# Altium schematic sheet LTC3119 Buck Boost Converter.SchDoc
size Letter; Organization: Altium Limited; Address1: L3, 12a Rodborough Rd; Address2: Frenchs Forest; Address3: NSW; Address4: Australia 2086; CopyrightYear: 2019
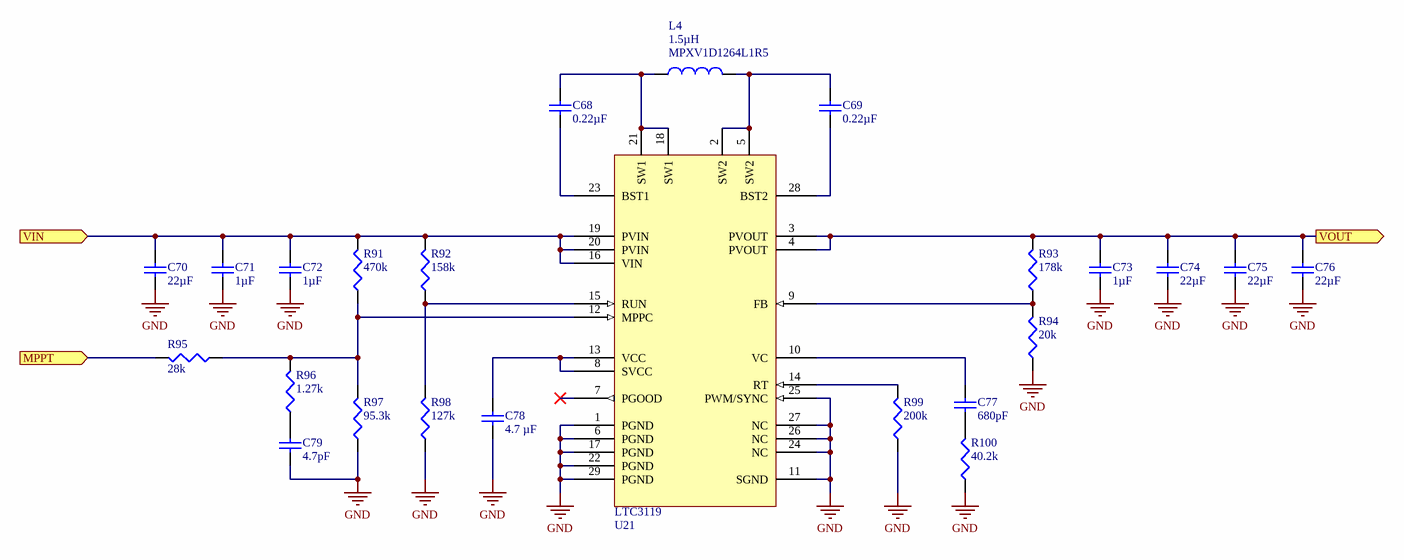
[diagram p0: LTC3119 Buck Boost Converter.SchDoc]

## Parts
C68  value 0.22µF  [TDK-CGA3E]  (hidden comment: Cap)
C69  value 0.22µF  [TDK-CGA3E]  (hidden comment: Cap)
C70  value 22µF  [TDK-C3225]  (hidden comment: Cap)
C71  value 1µF  [TY-0603A]  (hidden comment: Cap)
C72  value 1µF  [TY-0603A]  (hidden comment: Cap)
C73  value 1µF  [TY-0603A]  (hidden comment: Cap)
C74  value 22µF  [TDK-C3225]  (hidden comment: Cap)
C75  value 22µF  [TDK-C3225]  (hidden comment: Cap)
C76  value 22µF  [TDK-C3225]  (hidden comment: Cap)
C77  value 680pF  [TDK-CGA2B]  (hidden comment: Cap)
C78  value 4.7 µF  [MUR-GRM188]  (hidden comment: Cap)
C79  value 4.7pF  [TDK-CGA2B]  (hidden comment: Cap)
L4  value 1.5µH  Manufacturer Part Number: MPXV1D1264L1R5  [KEM-MPXV1D1264L100]  (hidden comment: Inductor)
R91  value 470k  [VSH-0402MCS]  (hidden comment: Res3)
R92  value 158k  [TEC-RP731E]  (hidden comment: Res3)
R93  value 178k  [TEC-RP731E]  (hidden comment: Res3)
R94  value 20k  [TEC-RP731E]  (hidden comment: Res3)
R95  value 28k  [TEC-RP731E]  (hidden comment: Res3)
R96  value 1.27k  [TEC-RP731E]  (hidden comment: Res3)
R97  value 95.3k  [TEC-RP731E]  (hidden comment: Res3)
R98  value 127k  [TEC-RP731E]  (hidden comment: Res3)
R99  value 200k  [TEC-RP731E]  (hidden comment: Res3)
R100  value 40.2k  [TEC-RP731E]  (hidden comment: Res3)
U21  LTC3119  [LT-05-08-1712C]

## Ports
MPPT (in), VIN (in), VOUT (out)

## Nets
GND: C70.1 C71.1 C72.1 C73.1 C74.1 C75.1 C76.1 C78.1 C79.1 R94.1 R97.1 R98.1 R99.1 R100.1 U21.1(PGND) U21.6(PGND) U21.11(SGND) U21.17(PGND) U21.22(PGND) U21.24(NC) U21.25(PWM/SYNC) U21.26(NC) U21.27(NC) U21.29(PGND)
MPPT: R95.2 ; port MPPT
VIN: C70.2 C71.2 C72.2 R91.2 R92.2 U21.16(VIN) U21.19(PVIN) U21.20(PVIN) ; port VIN
VOUT: C73.2 C74.2 C75.2 C76.2 R93.2 U21.3(PVOUT) U21.4(PVOUT) ; port VOUT
NetC68_1: C68.1 U21.23(BST1)
NetC68_2: C68.2 L4.1 U21.18(SW1) U21.21(SW1)
NetC69_1: C69.1 U21.28(BST2)
NetC69_2: C69.2 L4.2 U21.2(SW2) U21.5(SW2)
NetC77_1: C77.1 R100.2
NetC77_2: C77.2 U21.10(VC)
NetC78_2: C78.2 U21.8(SVCC) U21.13(VCC)
NetC79_2: C79.2 R96.1
NetR91_1: R91.1 R95.1 R96.2 R97.2 U21.12(MPPC)
NetR92_1: R92.1 R98.2 U21.15(RUN)
NetR93_1: R93.1 R94.2 U21.9(FB)
NetR99_2: R99.2 U21.14(RT)

Not connected (* = marked no-connect by the designer): U21 7(PGOOD)*

## Notes on the sheet
- (the "License"); you may not use or redistribute this file except in compliance with the License. You
- This file and the information within it are licensed under the terms of the Apache License, Version 2.0
- Copyright
- Unless required by applicable law or agreed to in writing, content distributed under the License is
- distributed on an "AS IS" BASIS, WITHOUT WARRANTIES OR CONDITIONS OF ANY KIND,
- either express or implied. See the License for the specific language governing permissions and
- limitations under the License.
- may obtain a copy of the License at:
- http://www.apache.org/licenses/LICENSE-2.0
- Title
- Size:
- Date:
- Letter
- Number:
- Time:
- Revision:
- Sheet
- of
- University of Alberta
- Deptartment of Electrical
- and Computer Engineering
- Edmonton AB, Canada
- T6G 1H9
- File:

## Library data of the parts
C68 C69 = PC-TDK-02393: CAP CER 0.22UF 50V X7R 0603; Manufacturer Part Number: CGA3E3X7R1H224K080AB; Index: 2393; Designator: C?; Tolerance: ±10%; Published: 2016-03-16; LatestRevisionDate: 2016-03-16; LatestRevisionNote: ...; PackageReference: 0603 (1608 Metric); Publisher: AlbertaSat; PackageDescription: Radial Cap, Thru-Hole; 2 Leads; 0.3 in Pin Spacing; Part Number: PC-TDK-02393; Supplier Part Number 1: 445-6926-1-ND; Supplier 1: Digi-key; Supplier Link: http://www.digikey.ca/product-search/en?keywords=445-6926-1-ND; Voltage - Rated: 50V; Temperature Coefficient: X7R; Applications: Automotive; Operating Temperature: -55°C ~ 125°C
C70 C74-C76 = PC-TDK-02965: CAP CER 22UF 25V X7R 1210; Manufacturer Part Number: C3225X7R1E226M250AB; Index: 2965; Designator: C?; Tolerance: ±20%; Code_IEC: 3225; Published: 2022-10-26; LatestRevisionDate: 2022-10-26; LatestRevisionNote: ...; PackageReference: 1210 (3225 Metric); Publisher: AlbertaSat; PackageDescription: Chip Capacitor, 2-Leads, Body 3.20x2.50mm, IPC Low Density; Part Number: PC-TDK-02965; Supplier Part Number 1: 445-181602-1-ND; Supplier 1: Digi-key; Supplier Part Number 2: 810-C3225X7R1EM250AB; Supplier 2: Mouser; Supplier Link: #https://www.digikey.ca/en/products/detail/tdk-corporation/C3225X7R1E226M250AB/9991387#; Voltage - Rated: 25V; Temperature Coefficient: X7R; Applications: General Purpose; Code_JEITA: 1210; Operating Temperature: -55°C ~ 125°C
C71-C73 = PC-TY-00404: CAP CER 1UF 50V X7R 0603; Manufacturer Part Number: UMK107AB7105KA-T; Index: 404; Designator: C?; Tolerance: ±10%; Published: 2016-03-13; LatestRevisionDate: 2016-03-13; LatestRevisionNote: ...; PackageReference: 0603 (1608 Metric); Publisher: AlbertaSat; PackageDescription: Chip Capacitor, 2-Leads, Body 1.60x0.80mm, IPC Low Density; Part Number: PC-TY-00404; Supplier Part Number 1: 587-3247-1-ND; Supplier 1: Digi-key; Supplier Link: http://www.digikey.ca/product-search/en?keywords=587-3247-1-ND; Voltage-Rated: 50V; Temperature Coefficient: X7R; Application: General Purpose; Operating Temperature: -55°C ~ 125°C
C77 = PC-TDK-01417: CAP CER 680PF 100V C0G 0402; Manufacturer Part Number: CGA2B1C0G2A681J050BC; Index: 1417; Designator: C?; Tolerance: ±5%; Temperature Coefficient: NP0; Published: 2016-03-16; LatestRevisionDate: 2016-03-16; LatestRevisionNote: ...; PackageReference: 0402 (1005 Metric); Publisher: AlbertaSat; PackageDescription: Radial Cap, Thru-Hole; 2 Leads; 0.3 in Pin Spacing; Part Number: PC-TDK-01417; Supplier Part Number 1: 445-172680-1-ND; Supplier 1: Digi-key; Supplier Link: http://www.digikey.ca/product-search/en?keywords=445-172680-1-ND; Voltage - Rated: 100V; Applications: Automotive; Operating Temperature: -55°C ~ 125°C
C78 = 10165: CAP CER 4.7UF 16V X7R 0603; Part Number: 10165; Manufacturer Part Number: GRM188Z71C475KE21D; Designator: C?; Tolerance: ±10%; Voltage - Rated: 25V; Published: 8-Jun-2000; LatestRevisionDate: 17-Jul-2002; LatestRevisionNote: Re-released for DXP Platform.; PackageReference: 0603 (1608 Metric); Publisher: Altium Limited; PackageDescription: Chip Capacitor, 2-Leads, Body 1.60x0.80mm, IPC Low Density; Supplier Part Number 1: 490-GRM188Z71C475KE21DCT-ND; Supplier 1: Digi-Key; Supplier Link: #https://www.digikey.ca/en/products/detail/murata-electronics/GRM188Z71C475KE21D/13401930#; Temperature Coefficient: X7R; Application: General Purpose; Operating Temperature: -55°C ~ 125°C; Supplier 2: Mouser; Supplier Part Number 2: 81-GRM188Z71C475KE1D
C79 = PC-TDK-01056: CAP CER 4.7PF 50V NP0 0402; Manufacturer Part Number: CGA2B2NP01H4R7C050BA; Index: 1056; Designator: C?; Tolerance: ±0.25pF; Published: 2016-03-16; LatestRevisionDate: 2016-03-16; LatestRevisionNote: ...; PackageReference: 0402 (1005 Metric); Publisher: AlbertaSat; PackageDescription: Radial Cap, Thru-Hole; 2 Leads; 0.3 in Pin Spacing; Part Number: PC-TDK-01056; Supplier Part Number 1: 445-12140-1-ND; Supplier 1: Digi-key; Supplier Link: http://www.digikey.ca/product-search/en?keywords=445-12140-1-ND; Voltage - Rated: 50V; Temperature Coefficient: NP0; Applications: Automotive; Operating Temperature: -55°C ~ 150°C
L4 = PL-KEM-03168: FIXED IND 1.5UH 28.8A 2.9MOHM SM; Code_IEC: 1005; Index: 3168; Designator: L?; Tolerance: ±20%; Published: 2022-11-26; LatestRevisionDate: 2023-05-04; LatestRevisionNote: Added operating temperature; PackageReference: 0.520" L x 0.492" W (13.20mm x 12.50mm); Publisher: AlbertaSat; PackageDescription: Precision Wire Wound Inductor, 2-Leads, Body 13.20x12.50mm, IPC Low Density; Code_JEITA: 0402; Part Number: PL-KEM-03168; Supplier Part Number 1: 399-MPXV1D1264L1R5CT-ND; Supplier 1: Digi-key; Supplier Part Number 2: 80-MPXV1D1264L1R5; Supplier 2: Mouser; Supplier Link: #https://www.digikey.ca/products/en?keywords=399-MPXV1D1264L100CT-ND#; Operating Temperature: -55°C ~ 155°C
R91 = PR-VSH-00330: RES 470K OHM 0.1% 1/16W 0402; Manufacturer Part Number: MCS0402MD4703BE000; Index: 330; Designator: R?; Power - Rated: 0.063W, 1/16W; Temperature Coefficient: ±25ppm/°C; Published: 2023-02-16; LatestRevisionDate: 2023-02-16; LatestRevisionNote: ...; PackageReference: 0402 (1005 Metric); Publisher: AlbertaSat; PackageDescription: Chip Resistor, 2-Leads, Body 1.00x0.50mm, IPC Low Density; Part Number: PR-VSH-00330; Supplier Part Number 1: 62AJ8660; Supplier 1: Newark; Supplier Link: https://www.digikey.ca/products/en?keywords=541-MCS0402MD4703BE000DKR-ND; Tolerance: ±0.1%; Operating Temperature: -55°C ~ 155°C
R92 = 905: RES 158K OHM 0.1% 1/10W 0402; Part Number: 905; Manufacturer Part Number: RP73PF1E158KBTD; Designator: R?; Temperature Coefficient: ±25ppm/°C; Power (Watts): 0.1W, 1/10W; Published: 8-Jun-2000; LatestRevisionDate: 29-May-2009; LatestRevisionNote: IPC-7351 Footprint Added.; PackageReference: 0402 (1005 Metric); Publisher: Altium Limited; PackageDescription: Chip Resistor, 2-Leads, Body 1.00x0.50mm, IPC Low Density; Supplier Part Number 1: A127530CT-ND; Supplier 1: Digi-Key; Supplier Link: http://www.digikey.ca/product-search/en?keywords=A127530CT-ND; Tolerance: ±0.1%; Operating Temperature: -55°C ~ 155°C
R93 = 910: RES 178K OHM 0.1% 1/10W 0402; Part Number: 910; Manufacturer Part Number: RP73PF1E178KBTD; Designator: R?; Temperature Coefficient: ±25ppm/°C; Power (Watts): 0.1W, 1/10W; Published: 8-Jun-2000; LatestRevisionDate: 29-May-2009; LatestRevisionNote: IPC-7351 Footprint Added.; PackageReference: 0402 (1005 Metric); Publisher: Altium Limited; PackageDescription: Chip Resistor, 2-Leads, Body 1.00x0.50mm, IPC Low Density; Supplier Part Number 1: A127535CT-ND; Supplier 1: Digi-Key; Supplier Link: http://www.digikey.ca/product-search/en?keywords=A127535CT-ND; Tolerance: ±0.1%; Operating Temperature: -55°C ~ 155°C
R94 = 819: RES 20K OHM 0.1% 1/10W 0402; Part Number: 819; Manufacturer Part Number: RP73PF1E20KBTD; Designator: R?; Temperature Coefficient: ±25ppm/°C; Power (Watts): 0.1W, 1/10W; Published: 8-Jun-2000; LatestRevisionDate: 29-May-2009; LatestRevisionNote: IPC-7351 Footprint Added.; PackageReference: 0402 (1005 Metric); Publisher: Altium Limited; PackageDescription: Chip Resistor, 2-Leads, Body 1.00x0.50mm, IPC Low Density; Supplier Part Number 1: A127444CT-ND; Supplier 1: Digi-Key; Supplier Link: http://www.digikey.ca/product-search/en?keywords=A127444CT-ND; Tolerance: ±0.1%; Operating Temperature: -55°C ~ 155°C
R95 = 833: RES 28K OHM 0.1% 1/10W 0402; Part Number: 833; Manufacturer Part Number: RP73PF1E28KBTD; Designator: R?; Temperature Coefficient: ±25ppm/°C; Power (Watts): 0.1W, 1/10W; Published: 8-Jun-2000; LatestRevisionDate: 29-May-2009; LatestRevisionNote: IPC-7351 Footprint Added.; PackageReference: 0402 (1005 Metric); Publisher: Altium Limited; PackageDescription: Chip Resistor, 2-Leads, Body 1.00x0.50mm, IPC Low Density; Supplier Part Number 1: A127458CT-ND; Supplier 1: Digi-Key; Supplier Link: http://www.digikey.ca/product-search/en?keywords=A127458CT-ND; Tolerance: ±0.1%; Operating Temperature: -55°C ~ 155°C
R96 = 704: RES 1.27K OHM 0.1% 1/10W 0402; Part Number: 704; Manufacturer Part Number: RP73PF1E1K27BTD; Designator: R?; Temperature Coefficient: ±25ppm/°C; Power (Watts): 0.1W, 1/10W; Published: 8-Jun-2000; LatestRevisionDate: 29-May-2009; LatestRevisionNote: IPC-7351 Footprint Added.; PackageReference: 0402 (1005 Metric); Publisher: Altium Limited; PackageDescription: Chip Resistor, 2-Leads, Body 1.00x0.50mm, IPC Low Density; Supplier Part Number 1: A127329CT-ND; Supplier 1: Digi-Key; Supplier Link: http://www.digikey.ca/product-search/en?keywords=A127329CT-ND; Tolerance: ±0.1%; Operating Temperature: -55°C ~ 155°C
R97 = 884: RES 95.3K OHM 0.1% 1/10W 0402; Part Number: 884; Manufacturer Part Number: RP73PF1E95K3BTD; Designator: R?; Temperature Coefficient: ±25ppm/°C; Power (Watts): 0.1W, 1/10W; Published: 8-Jun-2000; LatestRevisionDate: 29-May-2009; LatestRevisionNote: IPC-7351 Footprint Added.; PackageReference: 0402 (1005 Metric); Publisher: Altium Limited; PackageDescription: Chip Resistor, 2-Leads, Body 1.00x0.50mm, IPC Low Density; Supplier Part Number 1: A127509CT-ND; Supplier 1: Digi-Key; Supplier Link: http://www.digikey.ca/product-search/en?keywords=A127509CT-ND; Tolerance: ±0.1%; Operating Temperature: -55°C ~ 155°C
R98 = 896: RES 127K OHM 0.1% 1/10W 0402; Part Number: 896; Manufacturer Part Number: RP73PF1E127KBTD; Designator: R?; Temperature Coefficient: ±25ppm/°C; Power (Watts): 0.1W, 1/10W; Published: 8-Jun-2000; LatestRevisionDate: 29-May-2009; LatestRevisionNote: IPC-7351 Footprint Added.; PackageReference: 0402 (1005 Metric); Publisher: Altium Limited; PackageDescription: Chip Resistor, 2-Leads, Body 1.00x0.50mm, IPC Low Density; Supplier Part Number 1: A127521CT-ND; Supplier 1: Digi-Key; Supplier Link: http://www.digikey.ca/product-search/en?keywords=A127521CT-ND; Tolerance: ±0.1%; Operating Temperature: -55°C ~ 155°C
R99 = 915: RES 200K OHM 0.1% 1/10W 0402; Part Number: 915; Manufacturer Part Number: RP73PF1E200KBTD; Designator: R?; Temperature Coefficient: ±25ppm/°C; Power (Watts): 0.1W, 1/10W; Published: 8-Jun-2000; LatestRevisionDate: 29-May-2009; LatestRevisionNote: IPC-7351 Footprint Added.; PackageReference: 0402 (1005 Metric); Publisher: Altium Limited; PackageDescription: Chip Resistor, 2-Leads, Body 1.00x0.50mm, IPC Low Density; Supplier Part Number 1: A127540CT-ND; Supplier 1: Digi-Key; Supplier Link: http://www.digikey.ca/product-search/en?keywords=A127540CT-ND; Tolerance: ±0.1%; Operating Temperature: -55°C ~ 155°C
R100 = 848: RES 40.2K OHM 0.1% 1/10W 0402; Part Number: 848; Manufacturer Part Number: RP73PF1E40K2BTD; Designator: R?; Temperature Coefficient: ±25ppm/°C; Power (Watts): 0.1W, 1/10W; Published: 8-Jun-2000; LatestRevisionDate: 29-May-2009; LatestRevisionNote: IPC-7351 Footprint Added.; PackageReference: 0402 (1005 Metric); Publisher: Altium Limited; PackageDescription: Chip Resistor, 2-Leads, Body 1.00x0.50mm, IPC Low Density; Supplier Part Number 1: A127473CT-ND; Supplier 1: Digi-Key; Supplier Link: http://www.digikey.ca/product-search/en?keywords=A127473CT-ND; Tolerance: ±0.1%; Operating Temperature: -55°C ~ 155°C
U21 = PU-LTC-00059: IC REG BCK BST ADJ 5A 28QFN; Manufacturer Part Number: LTC3119IUFD#PBF; Index: 59; Designator: U?; Part Number: PU-LTC-00059; Supplier Part Number 1: 505-LTC3119IUFD#PBF-ND; Supplier 1: Digi-key; Supplier Part Number 2: 584-LTC3119IUFD#PBF; Supplier 2: Mouser; Publisher: AlbertaSat; Published: 2023-02-14; LatestRevisionDate: 2023-02-14; LatestRevisionNote: ...; PackageReference: 28-QFN (4x5); Supplier Link: https://www.digikey.ca/en/products/detail/analog-devices-inc/LTC3119IUFD-PBF/6419504; Operating Temperature: -40°C ~ 125°C (TA)